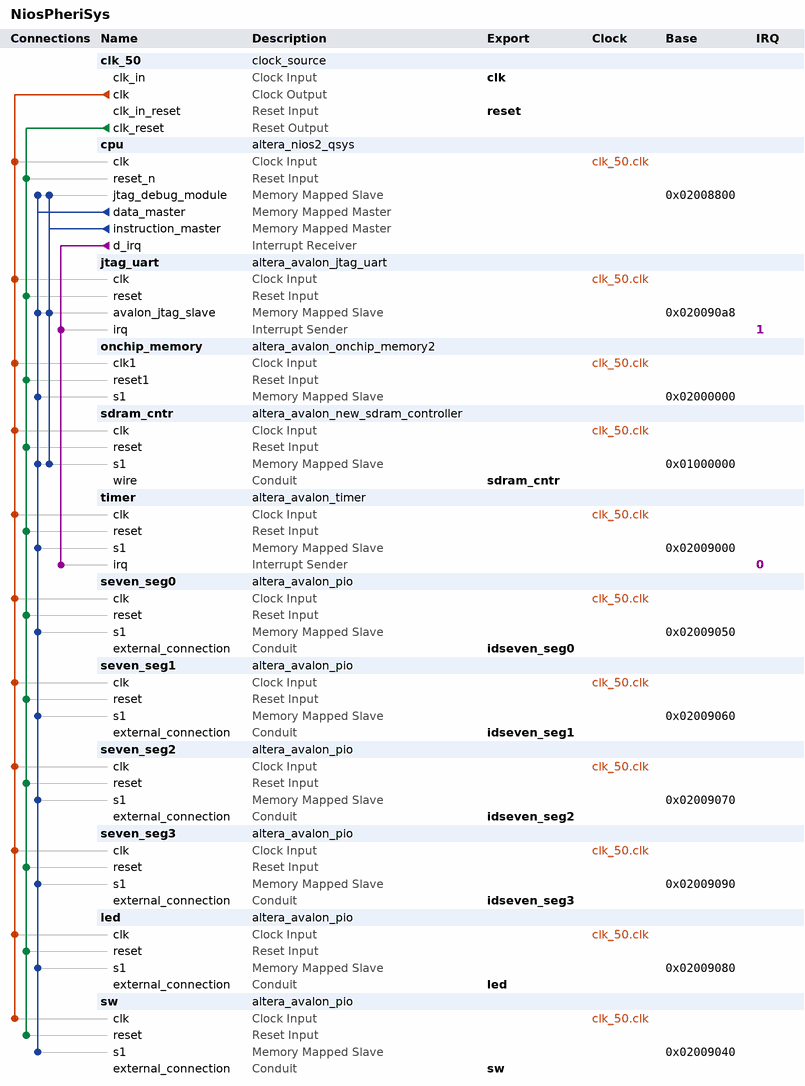
[diagram p0: system contents]
# Platform Designer (Qsys) system NiosPheriSys, Cyclone III EP3C16F484C6
# Parameters at their usual value, and those the tool derives, are not listed.
package require -exact qsys 13.0.1.99.2
create_system NiosPheriSys
set_project_property DEVICE_FAMILY {Cyclone III}
set_project_property DEVICE EP3C16F484C6

add_instance clk_50 clock_source 13.0
set_instance_parameter_value clk_50 clockFrequency 50000000

add_instance cpu altera_nios2_qsys 13.0
set_instance_parameter_value cpu resetSlave sdram_cntr.s1
set_instance_parameter_value cpu mmu_TLBMissExcSlave None
set_instance_parameter_value cpu exceptionSlave sdram_cntr.s1
set_instance_parameter_value cpu breakSlave cpu.jtag_debug_module
set_instance_parameter_value cpu impl Small
set_instance_parameter_value cpu icache_size 4096

add_instance jtag_uart altera_avalon_jtag_uart 13.0.1.99.2
set_instance_parameter_value jtag_uart simInteractiveOptions NO_INTERACTIVE_WINDOWS

add_instance onchip_memory altera_avalon_onchip_memory2 13.0.1.99.2
set_instance_parameter_value onchip_memory dataWidth 32
set_instance_parameter_value onchip_memory dualPort false
set_instance_parameter_value onchip_memory initMemContent true
set_instance_parameter_value onchip_memory initializationFileName onchip_mem.hex
set_instance_parameter_value onchip_memory memorySize 23000

add_instance sdram_cntr altera_avalon_new_sdram_controller 13.0.1.99.2
set_instance_parameter_value sdram_cntr TAC 5.5
set_instance_parameter_value sdram_cntr TRCD 20.0
set_instance_parameter_value sdram_cntr TRP 20.0
set_instance_parameter_value sdram_cntr casLatency 3
set_instance_parameter_value sdram_cntr columnWidth 8
set_instance_parameter_value sdram_cntr dataWidth 16
set_instance_parameter_value sdram_cntr generateSimulationModel false
set_instance_parameter_value sdram_cntr model single_Micron_MT48LC4M32B2_7_chip
set_instance_parameter_value sdram_cntr numberOfBanks 4
set_instance_parameter_value sdram_cntr numberOfChipSelects 1
set_instance_parameter_value sdram_cntr powerUpDelay 100.0
set_instance_parameter_value sdram_cntr refreshPeriod 15.625
set_instance_parameter_value sdram_cntr rowWidth 13

add_instance timer altera_avalon_timer 13.0.1.99.2
set_instance_parameter_value timer counterSize 64
set_instance_parameter_value timer period 1
set_instance_parameter_value timer periodUnits SEC

add_instance seven_seg0 altera_avalon_pio 13.0.1.99.2
set_instance_parameter_value seven_seg0 direction Output
set_instance_parameter_value seven_seg0 width 8

add_instance seven_seg1 altera_avalon_pio 13.0.1.99.2
set_instance_parameter_value seven_seg1 direction Output
set_instance_parameter_value seven_seg1 width 8

add_instance seven_seg2 altera_avalon_pio 13.0.1.99.2
set_instance_parameter_value seven_seg2 direction Output
set_instance_parameter_value seven_seg2 width 8

add_instance seven_seg3 altera_avalon_pio 13.0.1.99.2
set_instance_parameter_value seven_seg3 direction Output
set_instance_parameter_value seven_seg3 width 8

add_instance led altera_avalon_pio 13.0.1.99.2
set_instance_parameter_value led direction Output
set_instance_parameter_value led width 8

add_instance sw altera_avalon_pio 13.0.1.99.2
set_instance_parameter_value sw direction Input
set_instance_parameter_value sw width 8

# connections
add_connection clk_50.clk cpu.clk clock
add_connection clk_50.clk jtag_uart.clk clock
add_connection clk_50.clk led.clk clock
add_connection clk_50.clk onchip_memory.clk1 clock
add_connection clk_50.clk sdram_cntr.clk clock
add_connection clk_50.clk seven_seg0.clk clock
add_connection clk_50.clk seven_seg1.clk clock
add_connection clk_50.clk seven_seg2.clk clock
add_connection clk_50.clk seven_seg3.clk clock
add_connection clk_50.clk sw.clk clock
add_connection clk_50.clk timer.clk clock
add_connection clk_50.clk_reset cpu.reset_n reset
add_connection clk_50.clk_reset jtag_uart.reset reset
add_connection clk_50.clk_reset led.reset reset
add_connection clk_50.clk_reset onchip_memory.reset1 reset
add_connection clk_50.clk_reset sdram_cntr.reset reset
add_connection clk_50.clk_reset seven_seg0.reset reset
add_connection clk_50.clk_reset seven_seg1.reset reset
add_connection clk_50.clk_reset seven_seg2.reset reset
add_connection clk_50.clk_reset seven_seg3.reset reset
add_connection clk_50.clk_reset sw.reset reset
add_connection clk_50.clk_reset timer.reset reset
add_connection cpu.data_master cpu.jtag_debug_module avalon
set_connection_parameter_value cpu.data_master/cpu.jtag_debug_module baseAddress 0x02008800
add_connection cpu.data_master jtag_uart.avalon_jtag_slave avalon
set_connection_parameter_value cpu.data_master/jtag_uart.avalon_jtag_slave baseAddress 0x020090a8
add_connection cpu.data_master led.s1 avalon
set_connection_parameter_value cpu.data_master/led.s1 baseAddress 0x02009080
add_connection cpu.data_master onchip_memory.s1 avalon
set_connection_parameter_value cpu.data_master/onchip_memory.s1 baseAddress 0x02000000
add_connection cpu.data_master sdram_cntr.s1 avalon
set_connection_parameter_value cpu.data_master/sdram_cntr.s1 baseAddress 0x01000000
add_connection cpu.data_master seven_seg0.s1 avalon
set_connection_parameter_value cpu.data_master/seven_seg0.s1 baseAddress 0x02009050
add_connection cpu.data_master seven_seg1.s1 avalon
set_connection_parameter_value cpu.data_master/seven_seg1.s1 baseAddress 0x02009060
add_connection cpu.data_master seven_seg2.s1 avalon
set_connection_parameter_value cpu.data_master/seven_seg2.s1 baseAddress 0x02009070
add_connection cpu.data_master seven_seg3.s1 avalon
set_connection_parameter_value cpu.data_master/seven_seg3.s1 baseAddress 0x02009090
add_connection cpu.data_master sw.s1 avalon
set_connection_parameter_value cpu.data_master/sw.s1 baseAddress 0x02009040
add_connection cpu.data_master timer.s1 avalon
set_connection_parameter_value cpu.data_master/timer.s1 baseAddress 0x02009000
add_connection cpu.instruction_master cpu.jtag_debug_module avalon
set_connection_parameter_value cpu.instruction_master/cpu.jtag_debug_module baseAddress 0x02008800
add_connection cpu.instruction_master jtag_uart.avalon_jtag_slave avalon
set_connection_parameter_value cpu.instruction_master/jtag_uart.avalon_jtag_slave baseAddress 0x020090a8
add_connection cpu.instruction_master sdram_cntr.s1 avalon
set_connection_parameter_value cpu.instruction_master/sdram_cntr.s1 baseAddress 0x01000000
add_connection cpu.d_irq jtag_uart.irq interrupt
set_connection_parameter_value cpu.d_irq/jtag_uart.irq irqNumber 1
add_connection cpu.d_irq timer.irq interrupt
set_connection_parameter_value cpu.d_irq/timer.irq irqNumber 0

# exported interfaces
add_interface clk clock sink
set_interface_property clk EXPORT_OF clk_50.clk_in
add_interface reset reset sink
set_interface_property reset EXPORT_OF clk_50.clk_in_reset
add_interface sdram_cntr conduit end
set_interface_property sdram_cntr EXPORT_OF sdram_cntr.wire
add_interface idseven_seg0 conduit end
set_interface_property idseven_seg0 EXPORT_OF seven_seg0.external_connection
add_interface idseven_seg1 conduit end
set_interface_property idseven_seg1 EXPORT_OF seven_seg1.external_connection
add_interface idseven_seg2 conduit end
set_interface_property idseven_seg2 EXPORT_OF seven_seg2.external_connection
add_interface idseven_seg3 conduit end
set_interface_property idseven_seg3 EXPORT_OF seven_seg3.external_connection
add_interface led conduit end
set_interface_property led EXPORT_OF led.external_connection
add_interface sw conduit end
set_interface_property sw EXPORT_OF sw.external_connection

set_interconnect_requirement {$system} qsys_mm.clockCrossingAdapter HANDSHAKE
set_interconnect_requirement {$system} qsys_mm.maxAdditionalLatency 1

save_system NiosPheriSys.qsys
